# Altium schematic sheet Power Supply.SchDoc
size A4
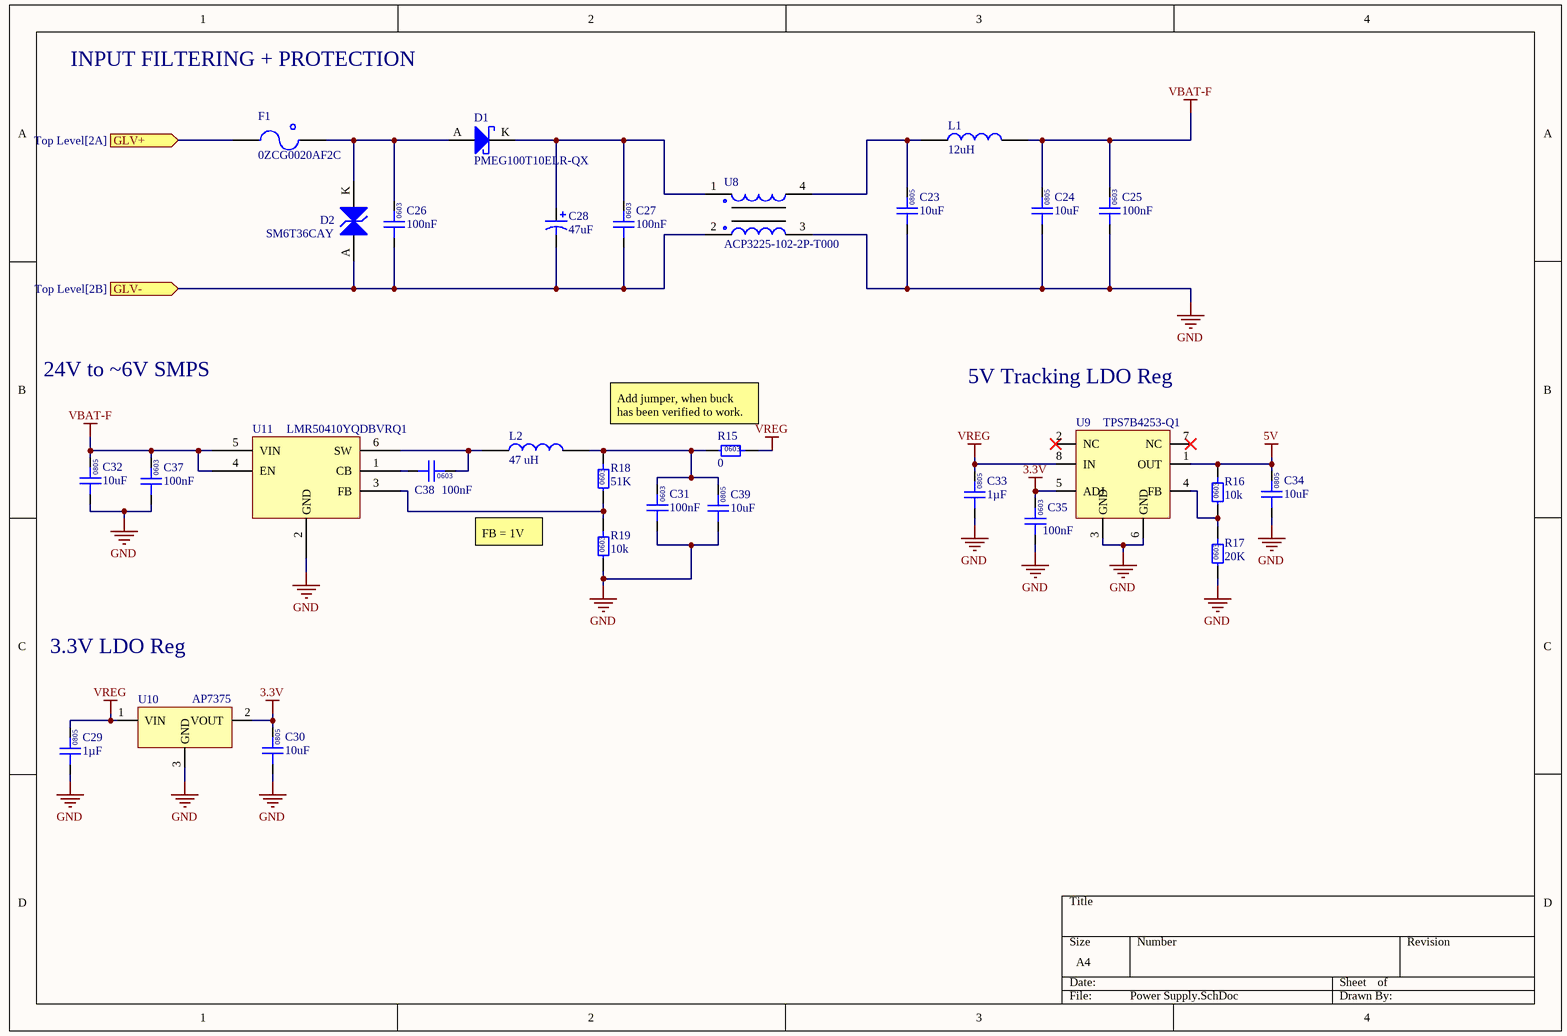
[diagram p0: Power Supply.SchDoc]

## Parts
C23  10uF  [0805]
C24  10uF  [0805]
C25  100nF  [0603]
C26  100nF  [0603]
C27  100nF  [0603]
C28  47uF  [CHEMI-CON ELCO]
C29  1µF  [0805]
C30  10uF  [0805]
C31  100nF  [0603]
C32  10uF  [0805]
C33  1µF  [0805]
C34  10uF  [0805]
C35  100nF  [0603]
C37  100nF  [0603]
C38  100nF  [0603]
C39  10uF  [0805]
D1  PMEG100T10ELR-QX  [NXP SOD123W]
D2  SM6T36CAY  [ST SMB DIODE]
F1  0ZCG0020AF2C  [1812 (PPTC FUSE)]
L1  12uH  [1812]
L2  47 uH  [SRN8040TA]
R15  0  [0603]
R16  10k  [0603]
R17  20K  [0603]
R18  51K  [0603]
R19  10k  [0603]
U8  ACP3225-102-2P-T000  [ACP3225]
U9  TPS7B4253-Q1  [TI 8-PowerSOIC]
U10  AP7375  [DI SOT-23-3]
U11  LMR50410YQDBVRQ1  [TI SOT-23-6]

## Ports
GLV+ (in, see Top Level[2A]), GLV- (in, see Top Level[2B])

## Nets
3.3V: C30.2 C35.2 U9.5(ADJ) U10.2(VOUT)
5V: C34.2 R16.2 U9.1(OUT)
GND: C23.1 C24.1 C25.1 C29.1 C30.1 C31.1 C32.1 C33.1 C34.1 C35.1 C37.1 C39.1 R17.1 R19.1 U8.3 U9.3(GND) U9.6(GND) U10.3(GND) U11.2(GND)
VBAT-F: C24.2 C25.2 C32.2 C37.2 L1.1 U11.4(EN) U11.5(VIN)
VREG: C29.2 C33.2 R15.2 U9.8(IN) U10.1(VIN)
GLV+: F1.1 ; port GLV+
GLV-: C26.1 C27.1 C28.1 D2.A U8.2 ; port GLV-
NetC23_2: C23.2 L1.2 U8.4
NetC26_2: C26.2 D1.A D2.K F1.2
NetC27_2: C27.2 C28.2 D1.K U8.1
NetC31_2: C31.2 C39.2 L2.1 R15.1 R18.2
NetC38_1: C38.1 U11.1(CB)
NetC38_2: C38.2 L2.2 U11.6(SW)
NetR16_1: R16.1 R17.2 U9.4(FB)
NetR18_1: R18.1 R19.2 U11.3(FB)

Not connected (* = marked no-connect by the designer): U9 2(NC)* 7(NC)*

## Notes on the sheet
- INPUT FILTERING + PROTECTION
- 24V to ~6V SMPS
- 5V Tracking LDO Reg
- Add jumper, when buck has been verified to work.
- FB = 1V
- 3.3V LDO Reg
- (in symbol GCM21BR71H105KA03L) 0805
- (in symbol GCM188L81H104KA57D) 0603
- (in symbol GRM21BR6YA106KE43L) 0805
- (in symbol RC0603FR-0710KL) 0603
- (in symbol RC0603FR-0720KL) 0603
- (in symbol RC0603JR-070RL) 0603
- (in symbol RC0603JR-0751KL) 0603

## Library data of the parts
C23 C24 C30 C32 C34 C39 = GRM21BR6YA106KE43L: Manufacturer: muRata; Rated Voltage: 50V; Tolerance: 10%; Material: MLCC; Temperature Rating: X5R; Part Number: GRM21BR6YA106KE43L; Value: 10uF; Digikey Part Number: 490-10514-6-ND
C25-C27 C31 C35 C37 C38 = GCM188L81H104KA57D: Manufacturer: muRata; Rated Voltage: 50V; Tolerance: ±10%; Material: MLCC; Temperature Rating: X8L; Part Number: GCM188L81H104KA57D; Value: 100nF; Digikey Part Number: 490-6049-1-ND
C28 = HHXA350ARA470MF61G: Part Number: HHXA350ARA470MF61G
C29 C33 = GCM21BR71H105KA03L: Manufacturer: muRata; Rated Voltage: 50V; Tolerance: ±10%; Material: MLCC; Temperature Rating: X7R; Part Number: GCM21BR71H105KA03L; Value: 1µF; Digikey Part Number: 490-10675-1-ND
D1 = PMEG100T10ELR-QX: Manufacturer: Nexperia USA Inc.; Forward Voltage: 0.75 V @ 1A; Breakdown Voltage: 100 V; Rated Power: 680 mW; Part Number: PMEG100T10ELR-QX; Digikey Part Number: 1727-PMEG100T10ELR-QXCT-ND
D2 = SM6T36CAY: Manufacturer: STMicroelectronics; Forward Voltage: 30.8 V; Rated Power: 600W; Part Number: SM6T36CAY; Breakdown Voltage: 30.8 V; Digikey Part Number: 497-10804-1-ND
F1 = 0ZCG0020AF2C: PTC RESET FUSE 60V 200MA 1812; Manufacturer: Bel Fuse Inc.; Part Number: 0ZCG0020AF2C; Digikey Part Number: 507-1757-1-ND
L1 = RLS-126: Manufacturer: Recom; Tolerance: 0.2; Impedance: 230mOhm; Rated Current: 0.8 A; Material: Wirewound; Part Number: RLS-126; Value: 12uH; Digikey Part Number: 945-3429-ND
L2 = SRN8040TA-470M: Manufacturer: Bourns; Tolerance: 0.2; Impedance: 135mOhms; Rated Current: 2A; Material: Wirewound; Part Number: SRN8040TA-470M; Value: 47 uH; Digikey Part Number: SRN8040TA-470MCT-ND
R15 = RC0603JR-070RL: Manufacturer: YAGEO; Tolerance: 0.01; Rated Power: 0.1W; Part Number: RC0603JR-070RL; Value: 0; Material: FR-07; Digikey Part Number: 311-0.0GRCT-ND
R16 R19 = RC0603FR-0710KL: Manufacturer: YAGEO; Tolerance: 0.01; Rated Power: 0.1W; Part Number: RC0603FR-0710KL; Value: 10k; Material: FR-07; Digikey Part Number: 311-10.0KHRCT-ND
R17 = RC0603FR-0720KL: Manufacturer: YAGEO; Tolerance: 0.01; Rated Power: 0.1W; Part Number: RC0603FR-0720KL; Value: 20K; Material: FR-07; Digikey Part Number: 311-20.0KHRCT-ND
R18 = RC0603JR-0751KL: Manufacturer: YAGEO; Tolerance: 0.01; Rated Power: 0.1W; Part Number: RC0603JR-0751KL; Value: 51K; Material: FR-07; Digikey Part Number: 311-51KGRCT-ND
U8 = ACP3225-102-2P-T000: Manufacturer: TDK Corporation; Tolerance: 0.25; Impedance: 1 kOhms @ 100MHz; Rated Current: 1.5 A; Part Number: ACP3225-102-2P-T000; Material: Wirewound; Digikey Part Number: 445-8637-1-ND
U9 = TPS7B4253-Q1: IC REG LIN POS ADJ 300MA 8SO; Manufacturer: Texas Instruments; Input Voltage: 40V; Output Voltage: Variable; Part Number: TPS7B4253-Q1; Output Current: 300 mA; Digikey Part Number: 296-43781-1-ND
U10 = AP7375-33SA-7: IC REG LIN 3.3V 300MA SOT23-3; Manufacturer: Diodes Incorporated; Input Voltage: 3V - 45V; Part Number: AP7375-33SA-7; Output Voltage: 3.3 V; Output Current: 300 mA; Digikey Part Number: 31-AP7375-33SA-7CT-ND
U11 = LMR50410YQDBVRQ1: IC REG BUCK ADJ 1A SOT23-6; Manufacturer: Texas Instruments; Input Voltage: 4V to 36V; Output Voltage: Variable; Output Current: 1.0 A; Part Number: LMR50410YQDBVRQ1; Digikey Part Number: 296-LMR50410YQDBVRQ1CT-ND